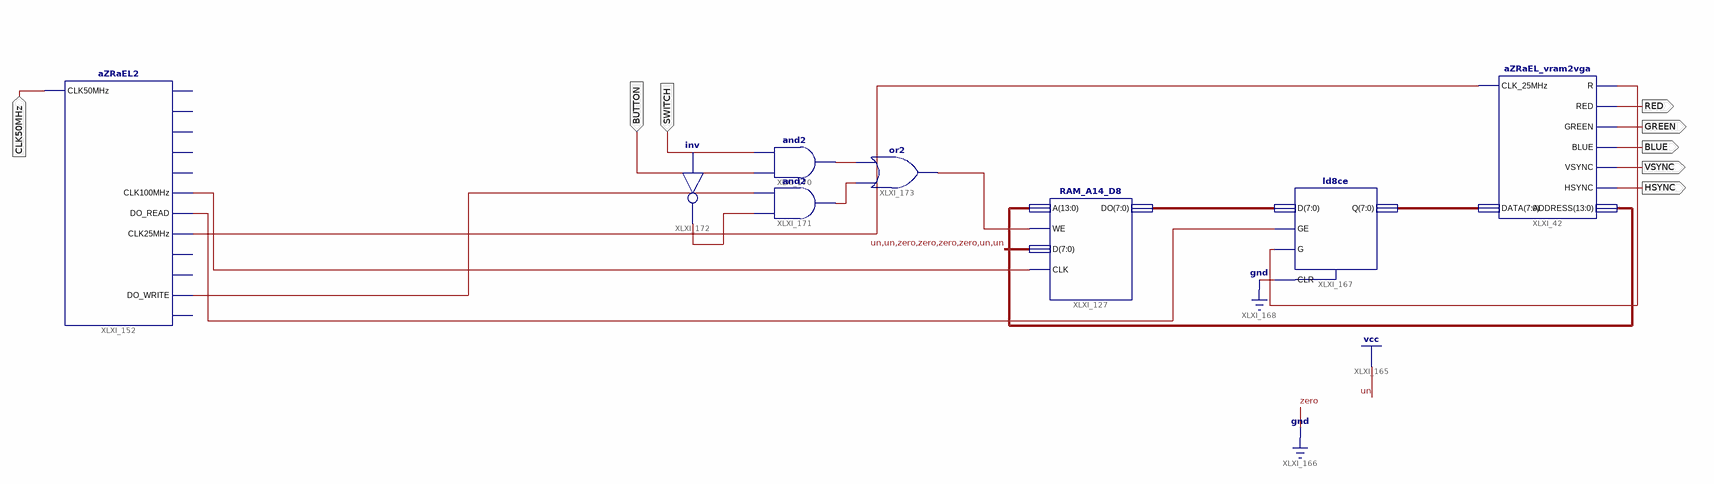
[diagram p0: schematic sheet 1]
// Xilinx ISE schematic aZRaEL_vga_vram_test.sch (spartan3) as structural Verilog: 8 symbols, 8 ports
module aZRaEL_vga_vram_test (
  input  CLK50MHz,
  input  SWITCH,
  input  BUTTON,
  output RED,
  output GREEN,
  output BLUE,
  output VSYNC,
  output HSYNC
);

  wire XLXN_267, XLXN_273, XLXN_313, XLXN_317, XLXN_321, XLXN_322, XLXN_323, XLXN_324, XLXN_325;
  wire [7:0] XLXN_162, XLXN_308;
  wire [13:0] XLXN_312;

  aZRaEL_vram2vga XLXI_42 (
    .CLK_25MHz(XLXN_267), .DATA(XLXN_162), .R(XLXN_313), .RED(RED), .GREEN(GREEN), .BLUE(BLUE),
    .VSYNC(VSYNC), .HSYNC(HSYNC), .ADDRESS(XLXN_312));
  RAM_A14_D8 XLXI_127 (.D(8'b11000011), .A(XLXN_312), .CLK(XLXN_273), .WE(XLXN_324), .DO(XLXN_308));
  aZRaEL2 XLXI_152 (
    .CLK50MHz(CLK50MHz), .CLK100MHz(XLXN_273), .DO_READ(XLXN_325), .CLK25MHz(XLXN_267), .DO_WRITE(XLXN_317));  // open: RED, GREEN, BLUE, VSYNC, HSYNC, CLK1MHz, PREPARE_WRITE, PREPARE_READ
  ld8ce XLXI_167 (.CLR(1'b0), .D(XLXN_308), .G(XLXN_313), .GE(XLXN_325), .Q(XLXN_162));
  and XLXI_170 (XLXN_322, BUTTON, SWITCH);
  and XLXI_171 (XLXN_323, XLXN_321, XLXN_317);
  not XLXI_172 (XLXN_321, SWITCH);
  or XLXI_173 (XLXN_324, XLXN_323, XLXN_322);
endmodule
